# EAGLE design ax (EAGLE 7.2.0)
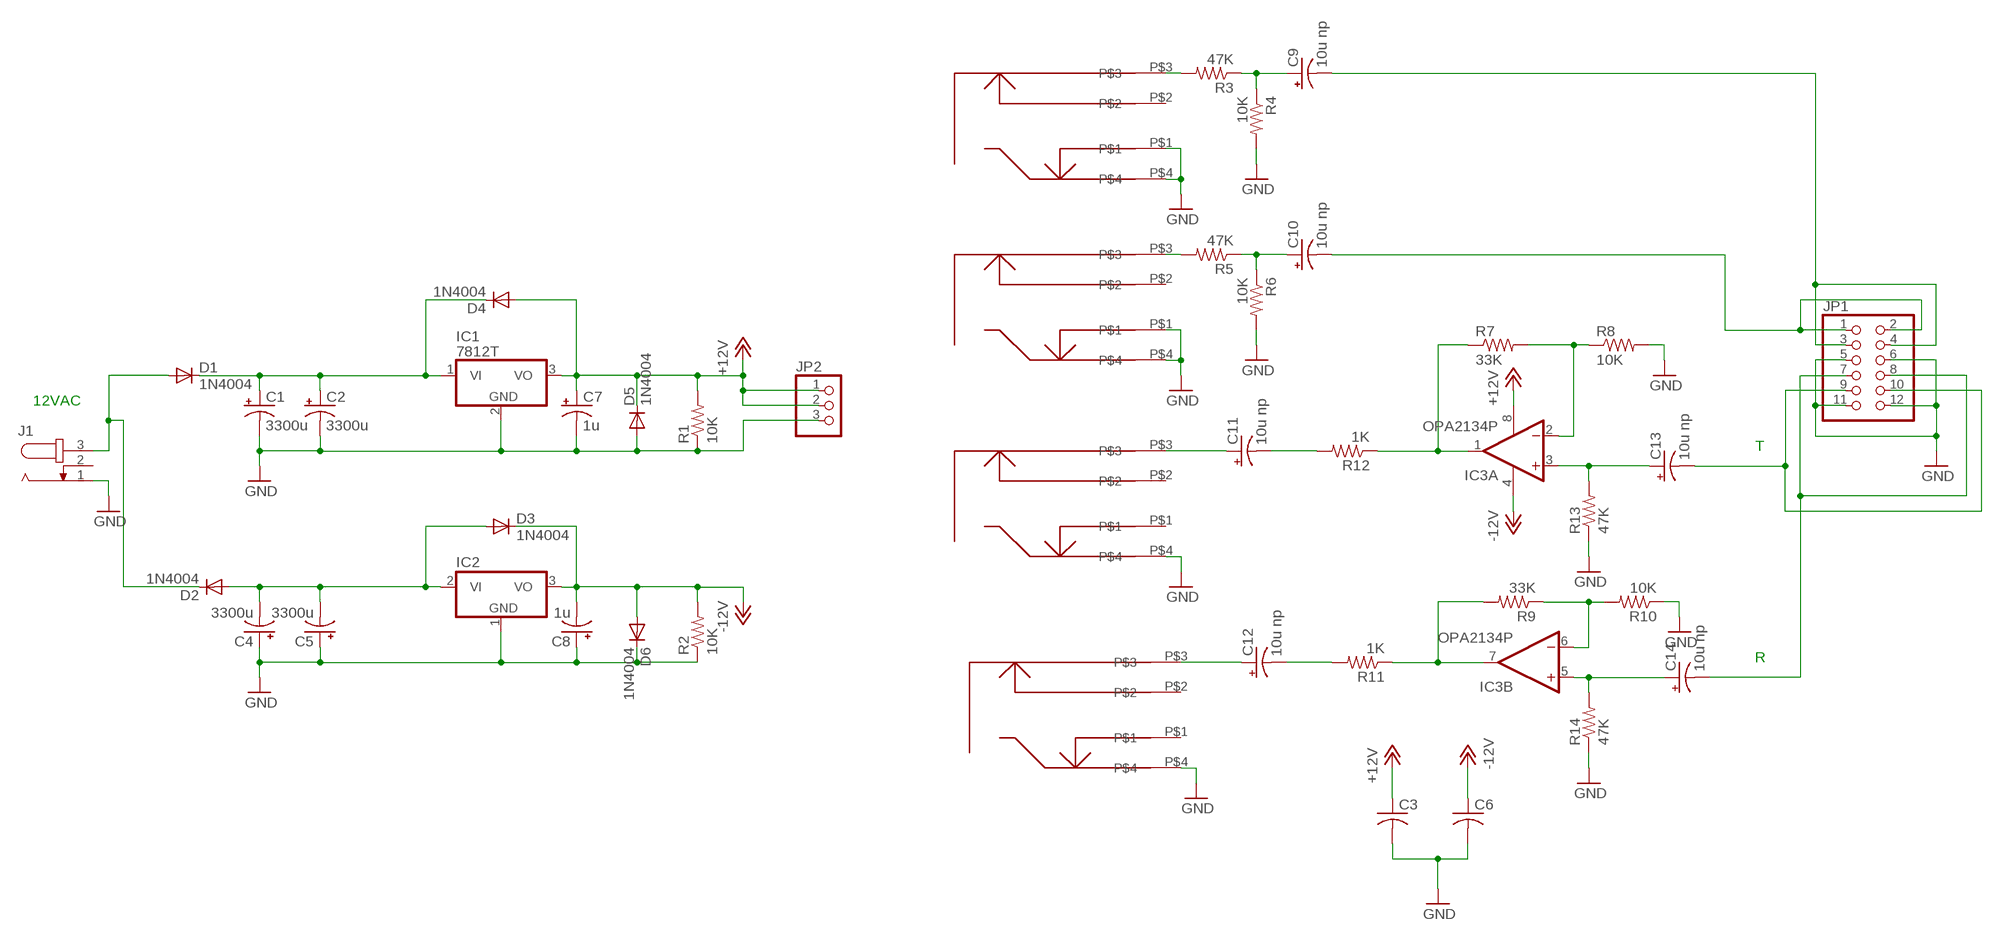
[diagram p0: schematic, sheet 1]

## Parts
C1  3300u  CPOL-USE7.5-18  [E7,5-18]
C2  3300u  CPOL-USE7.5-18  [E7,5-18]
C3  C-US050-030X075  [C050-030X075]
C4  3300u  CPOL-USE7.5-18  [E7,5-18]
C5  3300u  CPOL-USE7.5-18  [E7,5-18]
C6  C-US050-030X075  [C050-030X075]
C7  1u  CPOL-USE2-5  [E2-5]
C8  1u  CPOL-USE2-5  [E2-5]
C9  10u np  CPOL-USE2-5  [E2-5]
C10  10u np  CPOL-USE2-5  [E2-5]
C11  10u np  CPOL-USE2-5  [E2-5]
C12  10u np  CPOL-USE2-5  [E2-5]
C13  10u np  CPOL-USE2-5  [E2-5]
C14  10u np  CPOL-USE2-5  [E2-5]
D1  1N4004  [DO41-10]
D2  1N4004  [DO41-10]
D3  1N4004  [DO41-10]
D4  1N4004  [DO41-10]
D5  1N4004  [DO41-10]
D6  1N4004  [DO41-10]
IC1  7812T  [TO220H]
IC2  7906T  [TO220H]
IC3  OPA2134P  [DIL08]
INL  NMJ4HCD2  [NMJ4HCD2]
INR  NMJ4HCD2  [NMJ4HCD2]
J1  JACK-PLUG0  [SPC4077]
JP1  PINHD-2X6  [2X06]
JP2  PINHD-1X3  [1X03]
OUTL  NMJ4HCD2  [NMJ4HCD2]
OUTR  NMJ4HCD2  [NMJ4HCD2]
R1  10K  R-US_0207/7  [0207/7]
R2  10K  R-US_0207/7  [0207/7]
R3  47K  R-US_0207/7  [0207/7]
R4  10K  R-US_0207/7  [0207/7]
R5  47K  R-US_0207/7  [0207/7]
R6  10K  R-US_0207/7  [0207/7]
R7  33K  R-US_0207/7  [0207/7]
R8  10K  R-US_0207/7  [0207/7]
R9  33K  R-US_0207/7  [0207/7]
R10  10K  R-US_0207/7  [0207/7]
R11  1K  R-US_0207/7  [0207/7]
R12  1K  R-US_0207/7  [0207/7]
R13  47K  R-US_0207/7  [0207/7]
R14  47K  R-US_0207/7  [0207/7]

## Nets
+12V: C3.1 C7.+ D4.A D5.C IC1.3(VO) IC3.8(P:V+) JP2.1 JP2.2 R1.2
-12V: C6.1 C8.- D3.C D6.A IC2.3(VO) IC3.4(P:V-) R2.2
GND: C1.- C2.- C3.2 C4.+ C5.+ C6.2 C7.- C8.+ D5.A D6.C IC1.2(GND) IC2.1(GND) INL.P$1 INL.P$4 INR.P$1 INR.P$4 J1.1 JP1.5 JP1.6 JP1.11 JP1.12 JP2.3 OUTL.P$4 OUTR.P$4 R1.1 R2.1 R4.2 R6.2 R8.2 R10.1 R13.1 R14.1
N$1: INR.P$3 R5.2
N$2: INL.P$3 R3.2
N$3: C1.+ C2.+ D1.C D4.C IC1.1(VI)
N$4: C4.- C5.- D2.A D3.A IC2.2(VI)
N$5: C9.+ R3.1 R4.1
N$6: C10.+ R5.1 R6.1
N$7: C11.+ OUTL.P$3
N$8: IC3.1(A:OUT) R7.1 R12.1
N$9: C12.+ OUTR.P$3
N$10: IC3.7(B:OUT) R9.2 R11.1
N$11: IC3.2(A:-IN) R7.2 R8.1
N$12: IC3.6(B:-IN) R9.1 R10.2
N$13: C14.+ IC3.5(B:+IN) R14.2
N$14: C13.+ IC3.3(A:+IN) R13.2
N$15: C11.- R12.2
N$16: C14.- JP1.7 JP1.8
N$17: C13.- JP1.9 JP1.10
N$18: C10.- JP1.1 JP1.2
N$19: C12.- R11.2
N$20: C9.- JP1.3 JP1.4
N$21: D1.A D2.C J1.3
Unconnected: INL.P$2 INR.P$2 J1.2 OUTL.P$1 OUTL.P$2 OUTR.P$1 OUTR.P$2

## Notes on the sheet
- 12VAC
- T
- R

## Library data of the parts
C1 C2 C4 C5 C7-C14 = dan:CPOL-US: POLARIZED CAPACITOR, American symbol
C3 C6 = dan:C-US: CAPACITOR, American symbol
D1-D6 = dan:1N4004: DIODE general purpose rectifier, 1 A
IC1 = dan:78*: Positive VOLTAGE REGULATOR Source: http://cache.national.com/ds/LM/LM78L05.pdf http://www.fairchildsemi.com/ds/LM/LM7805.pdf
IC2 = dan:79*: Negative VOLTAGE REGULATOR
IC3 = dan:OPA2134: SoundPLUS (TM) High Performance AUDIO OPERATIONAL AMPLIFIERS Source: http://focus.ti.com/lit/ds/sbos058/sbos058.pdf
INL INR OUTL OUTR = dan:NMJ4HCD2
J1 = dan:JACK-PLUG: DC POWER JACK Power Jack, DC, Right Angle, Through Hole, Rated 5A at 16VDC, PC Terminals Distributor: Farnell (www.Farnell.de) Drawing: 84N1161.pdf / 84N1162.pdf Manufacturer: SPC Technology (www.spctechnology.com) Type: SPC4077 / SPC 4078; OC_FARNELL: unknown; OC_NEWARK: unknown
JP1 = dan:PINHD-2X6: PIN HEADER
JP2 = dan:PINHD-1X3: PIN HEADER
R1-R14 = dan:R-US_: RESISTOR, American symbol

## Board
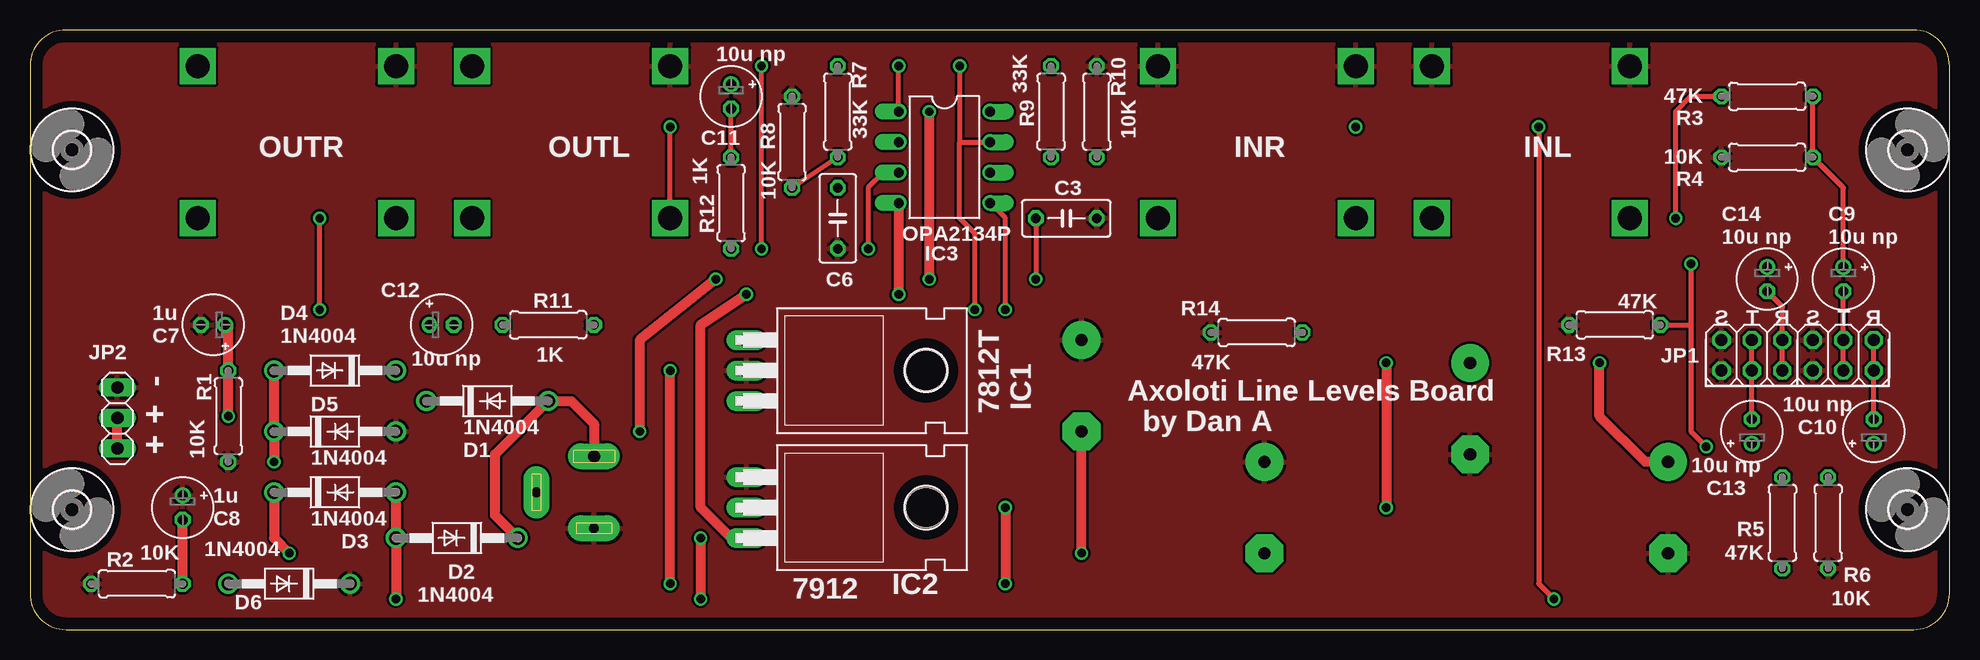
[diagram p1: board, top side]
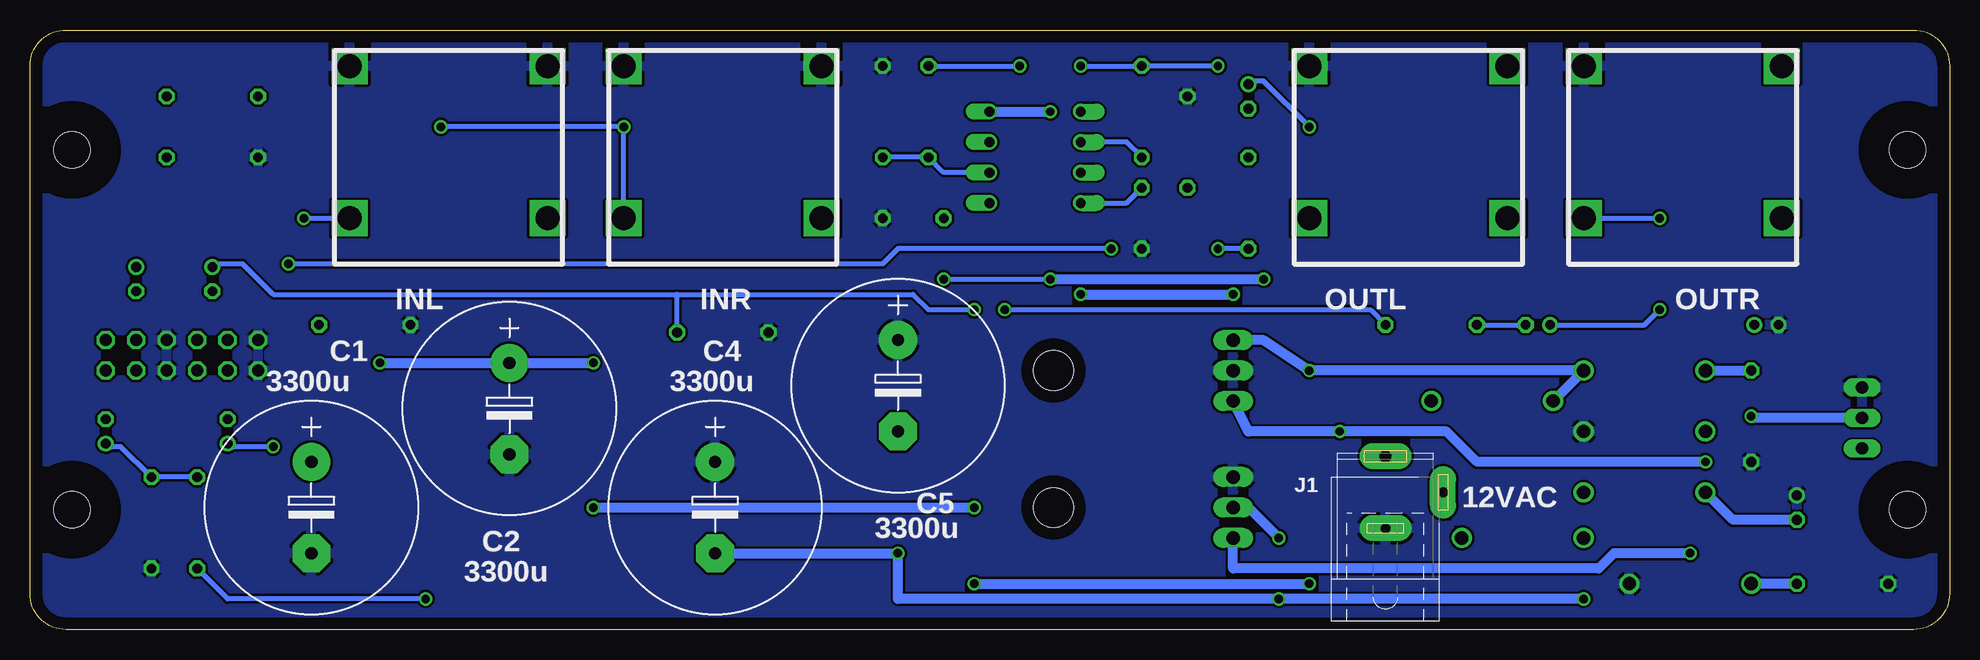
[diagram p2: board, bottom side, seen from below]

Size 160 x 50 mm. Coordinates in mm from the lower left corner, seen from the top.
Outline: 3,0 157,0 arc90 160,3 160,47 arc90 157,50 3,50 arc90 0,47 0,3 arc90 3,0
Copper layers (1*16): Top 0.035mm / dielectric 1.5mm / Bottom 0.035mm
Design rules "default": minimum track width 10mil, minimum drill 24mil, track to track 8mil, track to pad 8mil, pad to pad 8mil, via to via 8mil, smd to smd 8mil, copper to edge 40mil, drill to drill 8mil, minimum pad ring 10mil, minimum via ring 8mil, stop-mask expansion 4mil, vias tented up to drill 0mil, thermal gap 10mil

### Footprints (pad centres in the part's own frame; a part is rotated, then mirrored left to right if it is on the bottom)
E7,5-18 = drill 1.016 pad 3.15: + -3.81,0 | drill 1.016 pad 3.15 octagon: - 3.81,0
C050-030X075 = drill 0.813 octagon: 1 -2.54,0; 2 2.54,0
E2-5 = drill 0.813 pad 1.27: + -1.016,0 | drill 0.813 pad 1.27 octagon: - 1.016,0
DO41-10 = drill 1.118: A 5.08,0; C -5.08,0
3,0 = hole 3: 0,0
TO220H = drill 1.118 long: 1 -2.54,-10.16; 2 0,-10.16; 3 2.54,-10.16 | hole 3.302: 0,4.826
DIL08 = drill 0.813 offset: 1 -3.81,-3.81; 2 -1.27,-3.81; 3 1.27,-3.81; 4 3.81,-3.81; 5 3.81,3.81; 6 1.27,3.81; 7 -1.27,3.81; 8 -3.81,3.81
NMJ4HCD2 = drill 2 square: P$1 0,0; P$2 12.7,0; P$3 12.7,16.51; P$4 0,16.51
SPC4077 = drill 0.8 pad 2.184 long: 1 -3,0; 2 0,-4.8 | drill 1 pad 2.184 long: 3 3,0
2X06 = drill 1.016 octagon: 1 -6.35,-1.27; 2 -6.35,1.27; 3 -3.81,-1.27; 4 -3.81,1.27; 5 -1.27,-1.27; 6 -1.27,1.27; 7 1.27,-1.27; 8 1.27,1.27; 9 3.81,-1.27; 10 3.81,1.27; 11 6.35,-1.27; 12 6.35,1.27
1X03 = drill 1.016 long: 1 -2.54,0; 2 0,0; 3 2.54,0
0207/7 = drill 0.813 octagon: 1 -3.81,0; 2 3.81,0

### Placement (x,y rotation side)
C1  136.55,10.17 270 bottom
C2  120.03,18.43 270 bottom
C3  86.38,34.3 0 top
C4  102.89,10.17 270 bottom
C5  87.65,20.33 270 bottom
C6  67.33,34.3 270 top
C7  15.26,25.41 180 top
C8  12.72,10.17 270 top
C9  151.15,29.22 270 top
C10  153.69,16.52 90 top
C11  58.44,44.46 270 top
C12  34.31,25.41 0 top
C13  143.53,16.52 90 top
C14  144.8,29.22 270 top
D1  38.12,19.06 0 top
D2  35.58,7.63 180 top
D3  25.42,11.44 0 top
D4  25.42,21.6 180 top
D5  25.42,16.52 0 top
D6  21.61,3.82 180 top
H1  MOUNT-HOLE3.0  [3,0]  3.5,10 90 top
H2  MOUNT-HOLE3.0  [3,0]  3.5,40 90 top
H4  MOUNT-HOLE3.0  [3,0]  156.5,10 90 top
H6  MOUNT-HOLE3.0  [3,0]  156.5,40 0 top
IC1  69.87,21.6 270 top
IC2  69.87,10.17 270 top
IC3  76.22,39.38 270 top
INL  116.86,47 270 top
INR  94,47 270 top
J1  47.01,11.44 90 bottom
JP1  147.34,22.87 180 top
JP2  7.29,17.64 90 top
OUTL  36.85,47 270 top
OUTR  13.99,47 270 top
R1  16.53,17.79 90 top
R2  8.91,3.82 0 top
R3  144.8,44.46 180 top
R4  144.8,39.38 180 top
R5  146.07,8.9 270 top
R6  149.88,8.9 270 top
R7  67.33,43.19 270 top
R8  63.52,40.65 90 top
R9  85.11,43.19 90 top
R10  88.92,43.19 270 top
R11  43.2,25.41 180 top
R12  58.44,35.57 90 top
R13  132.1,25.41 0 top
R14  102.25,24.78 0 top

### Tracks (layer width: path | path; a pad name or v marks a point on that pad's centre or on a via)
+12V  (via drill 0.7)
  Top 0.406: 16.53,25.16 C7.+ | C3.1 v83.84,29.22
  Top 0.813: D4.A D5.C v20.34,13.98 | 16.53,25.16 R1.2 v16.53,17.79 | JP2.1 JP2.2 | v74.95,43.19 v74.95,29.22 | v50.82,16.52 50.82,24.14 v57.17,29.22
  Bottom 0.406: 16.38,17.64 v16.53,17.79 | v50.82,16.52 52.09,16.52 | v83.84,29.22 v74.95,29.22
  Bottom 0.813: D4.A R1.2 | JP2.2 16.38,17.64 | v20.34,13.98 39.39,13.98 41.93,16.52 v50.82,16.52 58.44,16.52 IC1.3 | IC3.8 v74.95,43.19 | v74.95,29.22 v57.17,29.22
-12V  (via drill 0.7)
  Top 0.813: R2.2 C8.- | D3.C 20.34,7.63 v21.61,6.36 | IC3.4 v72.41,27.95 | IC2.3 58.44,7.63 55.9,10.17 55.9,25.41 v59.71,27.95
  Bottom 0.406: IC3.4 68.6,35.57 C6.1
  Bottom 0.813: R2.2 D6.A | C8.- 18.05,9.15 D3.C | v21.61,6.36 27.96,6.36 29.23,5.09 59.71,5.09 IC2.3 | v72.41,27.95 v59.71,27.95
GND
  pour Top: -1.25,52.08 161.31,52.08 161.31,-1.26 -1.25,-1.26
  pour Bottom: -2.52,54.62 165.12,54.62 165.12,-5.07 -2.52,-5.07
N$1  (via drill 0.7)
  Top 0.406: v125.75,41.92 125.75,3.82 v127.02,2.55
  Bottom 0.406: v125.75,41.92 v110.51,41.92 INR.P$3 | v127.02,2.55 143.53,2.55 R5.2
N$2  (via drill 0.7)
  Top 0.406: v137.18,34.3 137.18,43.19 138.45,44.46 R3.2
  Bottom 0.406: v137.18,34.3 INL.P$3
N$3  (via drill 0.7)
  Top 0.813: v113.05,22.24 v113.05,10.17 | v81.3,10.17 v81.3,3.82 | v53.36,3.82 v53.36,21.6 | C1.+ 134.64,13.98 130.83,17.79 v130.83,22.24
  Bottom 0.813: D1.C D4.C v53.36,21.6 57.17,24.14 IC1.1 | v130.83,22.24 C2.+ v113.05,22.24 | v113.05,10.17 v81.3,10.17 | v81.3,3.82 v53.36,3.82
N$4  (via drill 0.7)
  Top 0.813: v87.65,6.36 C5.- | v30.5,2.55 D2.A D3.A | v55.9,7.63 v55.9,2.55
  Bottom 0.813: v30.5,2.55 v55.9,2.55 87.65,2.55 v87.65,6.36 C4.- | IC2.2 58.44,10.17 v55.9,7.63
N$5
  Top 0.406: C9.+ 151.15,36.84 R4.1 R3.1
N$6
  Bottom 0.406: R5.1 R6.1 152.42,15.25 153.44,15.25 C10.+
N$7  (via drill 0.7)
  Top 0.406: OUTL.P$3 v53.36,41.92
  Bottom 0.406: v53.36,41.92 57.17,45.73 58.19,45.73 C11.+
N$8  (via drill 0.7)
  Top 0.406: IC3.1 v72.41,47 | v60.98,31.76 v60.98,47
  Bottom 0.406: v72.41,47 R7.1 v60.98,47 | R12.1 v60.98,31.76
N$9  (via drill 0.7)
  Top 0.406: v24.15,26.68 v24.15,34.3
  Bottom 0.406: C12.+ 25.42,25.41 v24.15,26.68 | 25.42,34.3 v24.15,34.3 OUTR.P$3
N$10  (via drill 0.7)
  Top 0.406: 77.49,40.65 IC3.7 | v77.49,47 77.49,40.65 | v78.76,26.68 78.76,33.03 77.49,34.3 77.49,40.65
  Bottom 0.406: R9.2 v77.49,47 | v78.76,26.68 48.28,26.68 R11.1
N$11
  Top 0.406: R8.1 R7.2
  Bottom 0.406: R7.2 68.6,40.65 IC3.2
N$12
  Bottom 0.406: R10.2 R9.1 83.84,38.11 IC3.6
N$13  (via drill 0.7)
  Top 0.406: v81.3,26.68 81.3,34.3 IC3.5
  Bottom 0.406: C14.+ 144.55,30.49 142.26,30.49 139.72,27.95 106.06,27.95 | 106.06,27.95 86.38,27.95 85.11,26.68 v81.3,26.68 | R14.2 106.06,27.95
N$14  (via drill 0.7)
  Top 0.406: IC3.3 71.14,38.11 69.87,36.84 v69.87,31.76 | v138.45,30.49 138.45,25.41 | 138.45,25.41 138.45,16.52 v139.72,15.25 | R13.2 138.45,25.41
  Bottom 0.406: v69.87,31.76 87.65,31.76 88.92,30.49 v138.45,30.49 | v139.72,15.25 143.28,15.25 C13.+
N$15
  Top 0.406: R12.2 C11.-
N$16
  Top 0.406: JP1.8 JP1.7 146.07,26.93 C14.-
N$17
  Top 0.406: JP1.9 JP1.10 C13.-
N$18
  Top 0.406: JP1.1 JP1.2 C10.-
N$19
  Bottom 0.406: R11.2 C12.-
N$20
  Top 0.406: C9.- JP1.3 JP1.4
N$21
  Top 0.813: J1.3 47.01,17.16 45.11,19.06 D1.A 38.76,14.62 38.76,9.54 D2.C

### Text on the board
tPlace: OUTR | OUTL | INR | INL | S | T | R | S | T | R | - | + | Axoloti Line Levels Board | by Dan A | + | 7912
bPlace: OUTR | OUTL | INR | INL | 12VAC